# Altium schematic sheet hvsupply_schem.SchDoc
size A4
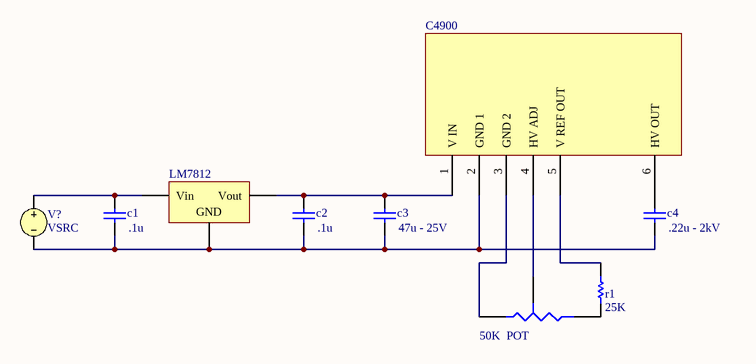
[diagram p0: hvsupply_schem.SchDoc]

## Parts
*  C4900
c1  value .1u  [RAD-0.3]  (hidden comment: Cap)
c2  value .1u  [RAD-0.3]
c3  value 47u - 25V  [RAD-0.3]  (hidden comment: Cap)
c4  value .22u - 2kV  [RAD-0.3]  (hidden comment: Cap)
LM7812  Volt Reg  [D2PAK_N]  (value not drawn)
POT  value 50K  [VR3]  (hidden comment: Res Tap)
RA  r1  value 25K  [AXIAL-0.3]
V?  VSRC

## Nets
Net*_1: *.1(V_IN) c2.2 c3.2 LM7812.3(Vout)
Net*_2: *.2(GND_1) c1.1 c2.1 c3.1 c4.1 LM7812.2(GND) V?.2
Net*_3: *.3(GND_2) POT.1(A)
Net*_4: *.4(HV_ADJ) POT.3(TAP)
Net*_5: *.5(V_REF_OUT) RA.2
Net*_6: *.6(HV_OUT) c4.2
Netc1_2: c1.2 LM7812.1(Vin) V?.1
NetPOT_2: POT.2(B) RA.1

## Library data of the parts
c1-c4 = Cap: Capacitor; Published: 8-Jun-2000; LatestRevisionDate: 17-Jul-2002; LatestRevisionNote: Re-released for DXP Platform.; PackageReference: RAD-0.3; Publisher: Altium Limited; PackageDescription: Radial Cap, Thru-Hole; 2 Leads; 0.3 in Pin Spacing
LM7812 = Volt Reg: Voltage Regulator; Published: 24-Mar-1999; LatestRevisionDate: 29-May-2009; LatestRevisionNote: IPC-7351 Footprint Added.; PackageReference: D2PAK; Publisher: Altium Limited; PackageDescription: 3-Pin Transistor Outline Package 2.54 mm Pitch, 15.1 mm Lead Span
POT = Res Tap: Tapped Resistor; Sim Note: Enter the Resistance value and the set point into parameter fields.; Set Position: 0.5; Published: 24-Mar-1999; LatestRevisionDate: 17-Jul-2002; LatestRevisionNote: Re-released for DXP Platform.; PackageReference: VR3; Publisher: Altium Limited; PackageDescription: Variable Resistor, Thru-Hole; 3 Leads
RA = Res1: Resistor; Published: 8-Jun-2000; LatestRevisionDate: 17-Jul-2002; LatestRevisionNote: Re-released for DXP Platform.; PackageReference: AXIAL-0.3; Publisher: Altium Limited; PackageDescription: Axial Device, Thru-Hole; 2 Leads; 0.3 in Pin Spacing
V? = VSRC: Voltage Source; Note: PCB Footprint - Not required; Published: 8-Jun-2000; LatestRevisionDate: 17-Jul-2002; LatestRevisionNote: Re-released for DXP Platform.; PackageReference: Not Applicable; Publisher: Altium Limited